# EAGLE design Multiplex Horizontal (EAGLE 7.5.0)
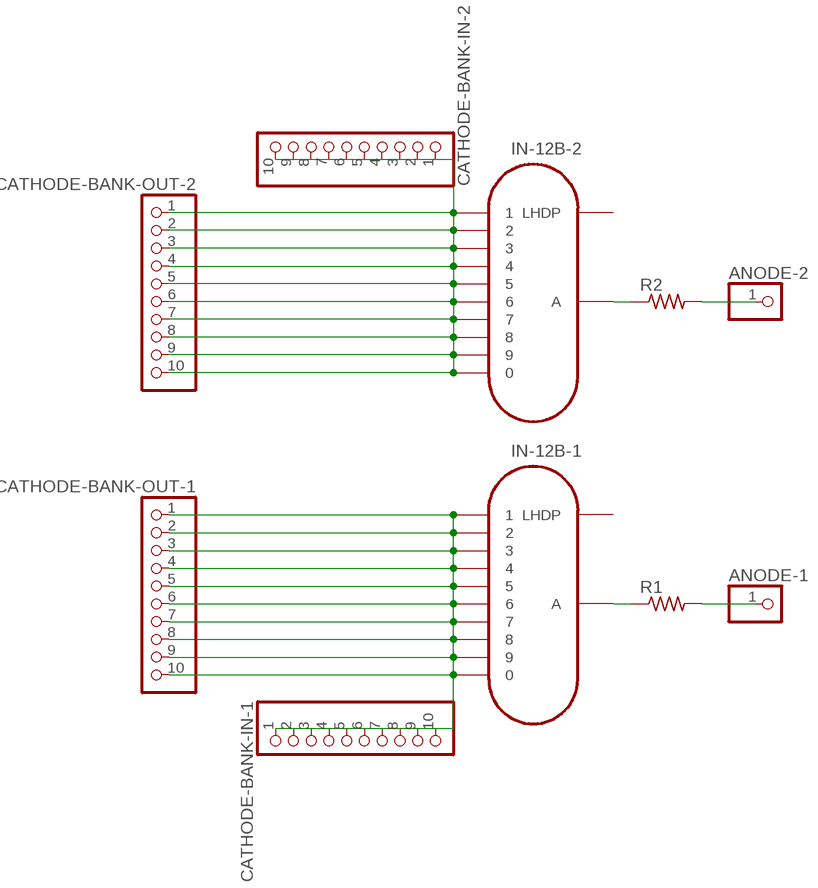
[diagram p0: schematic, sheet 1]

## Parts
ANODE-1  PINHD-1X1  [1X01]
ANODE-2  PINHD-1X1  [1X01]
CATHODE-BANK-IN-1  PINHD-1X10  [1X10]
CATHODE-BANK-IN-2  PINHD-1X10  [1X10]
CATHODE-BANK-OUT-1  PINHD-1X10  [1X10]
CATHODE-BANK-OUT-2  PINHD-1X10  [1X10]
IN-12B-1  IN-12B  [IN-12]
IN-12B-2  IN-12B  [IN-12]
R1  R-US_0207/7  [0207/7]
R2  R-US_0207/7  [0207/7]

## Nets
N$1: IN-12B-2.A R2.1
N$2: CATHODE-BANK-IN-2.1 CATHODE-BANK-OUT-2.1 IN-12B-2.1
N$3: CATHODE-BANK-IN-2.2 CATHODE-BANK-OUT-2.2 IN-12B-2.2
N$4: CATHODE-BANK-IN-2.3 CATHODE-BANK-OUT-2.3 IN-12B-2.3
N$5: IN-12B-1.A R1.1
N$6: CATHODE-BANK-IN-2.5 CATHODE-BANK-OUT-2.5 IN-12B-2.5
N$7: CATHODE-BANK-IN-2.6 CATHODE-BANK-OUT-2.6 IN-12B-2.6
N$8: CATHODE-BANK-IN-2.7 CATHODE-BANK-OUT-2.7 IN-12B-2.7
N$9: CATHODE-BANK-IN-2.8 CATHODE-BANK-OUT-2.8 IN-12B-2.8
N$10: ANODE-2.1 R2.2
N$11: CATHODE-BANK-IN-2.9 CATHODE-BANK-OUT-2.9 IN-12B-2.9
N$12: ANODE-1.1 R1.2
N$13: CATHODE-BANK-IN-1.1 CATHODE-BANK-OUT-1.1 IN-12B-1.1
N$14: CATHODE-BANK-IN-1.2 CATHODE-BANK-OUT-1.2 IN-12B-1.2
N$15: CATHODE-BANK-IN-1.3 CATHODE-BANK-OUT-1.3 IN-12B-1.3
N$16: CATHODE-BANK-IN-1.4 CATHODE-BANK-OUT-1.4 IN-12B-1.4
N$17: CATHODE-BANK-IN-1.5 CATHODE-BANK-OUT-1.5 IN-12B-1.5
N$18: CATHODE-BANK-IN-1.6 CATHODE-BANK-OUT-1.6 IN-12B-1.6
N$19: CATHODE-BANK-IN-1.7 CATHODE-BANK-OUT-1.7 IN-12B-1.7
N$20: CATHODE-BANK-IN-1.8 CATHODE-BANK-OUT-1.8 IN-12B-1.8
N$21: CATHODE-BANK-IN-1.9 CATHODE-BANK-OUT-1.9 IN-12B-1.9
N$22: CATHODE-BANK-IN-2.10 CATHODE-BANK-OUT-2.10 IN-12B-2.0
N$23: CATHODE-BANK-IN-1.10 CATHODE-BANK-OUT-1.10 IN-12B-1.0
N$24: CATHODE-BANK-IN-2.4 CATHODE-BANK-OUT-2.4 IN-12B-2.4
Unconnected: IN-12B-1.LHDP IN-12B-2.LHDP

## Library data of the parts
ANODE-1 ANODE-2 = pinhead:PINHD-1X1: PIN HEADER
CATHODE-BANK-IN-1 CATHODE-BANK-IN-2 CATHODE-BANK-OUT-1 CATHODE-BANK-OUT-2 = pinhead:PINHD-1X10: PIN HEADER
IN-12B-1 IN-12B-2 = russian-nixies:IN-12B: IN-12B: medium numeric topview nixie tube
R1 R2 = resistor:R-US_: RESISTOR, American symbol

## Board
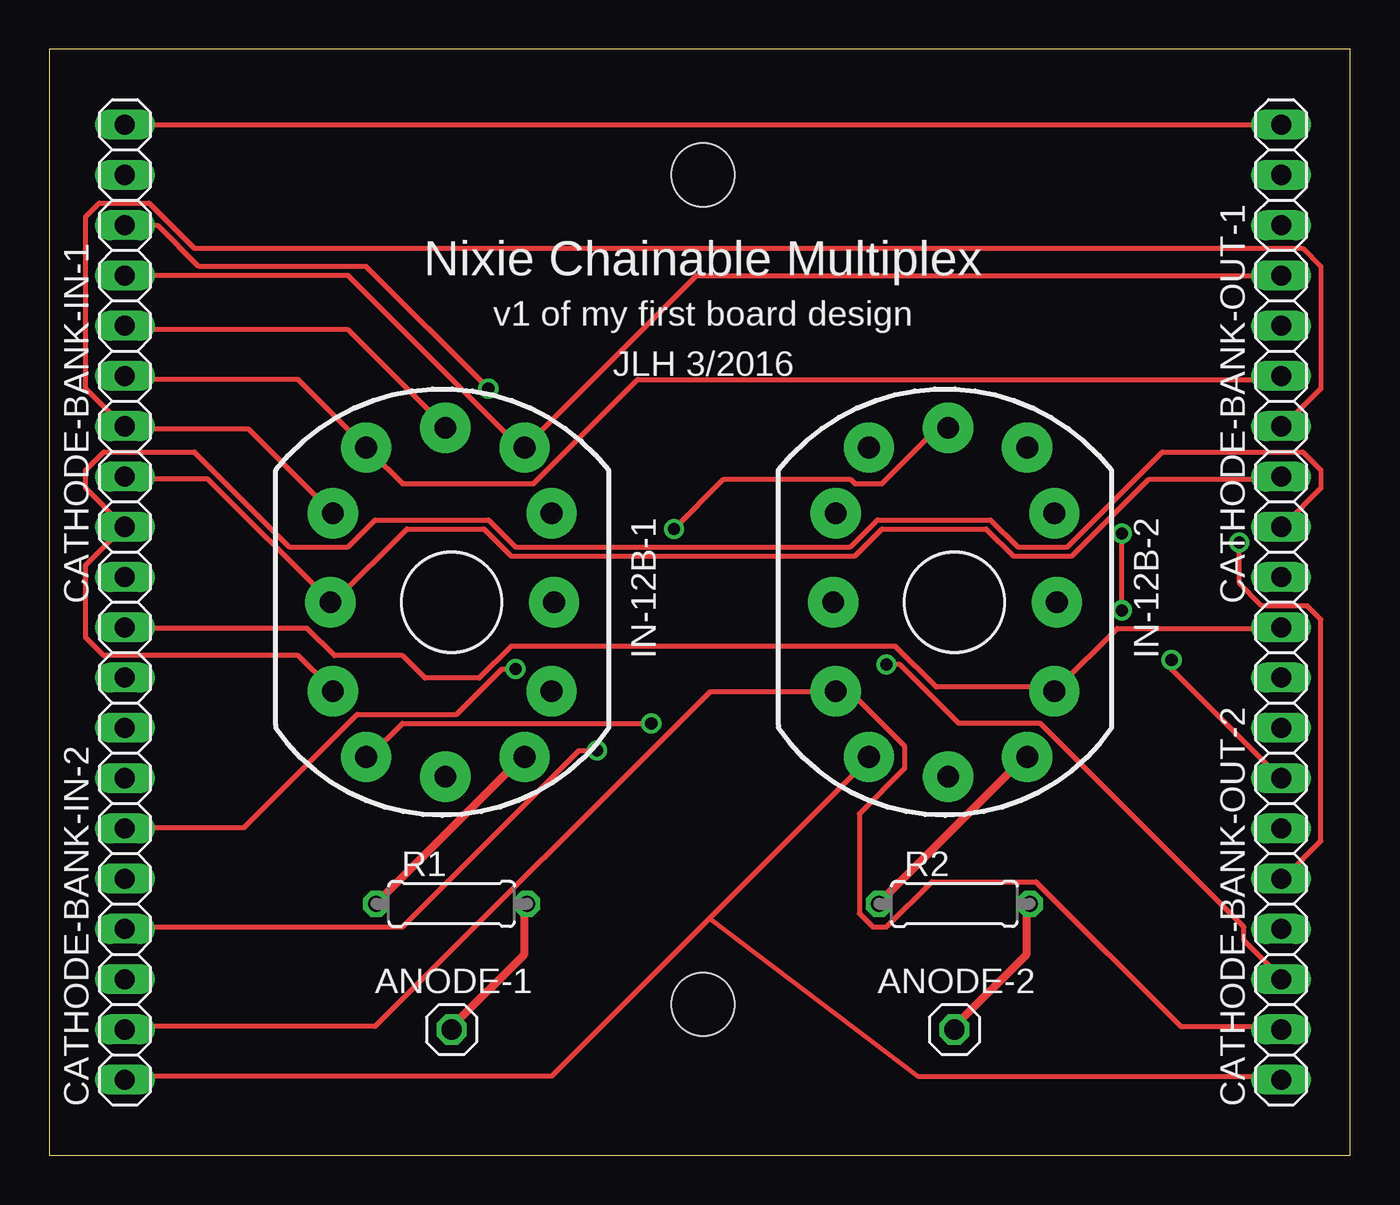
[diagram p1: board, top side]
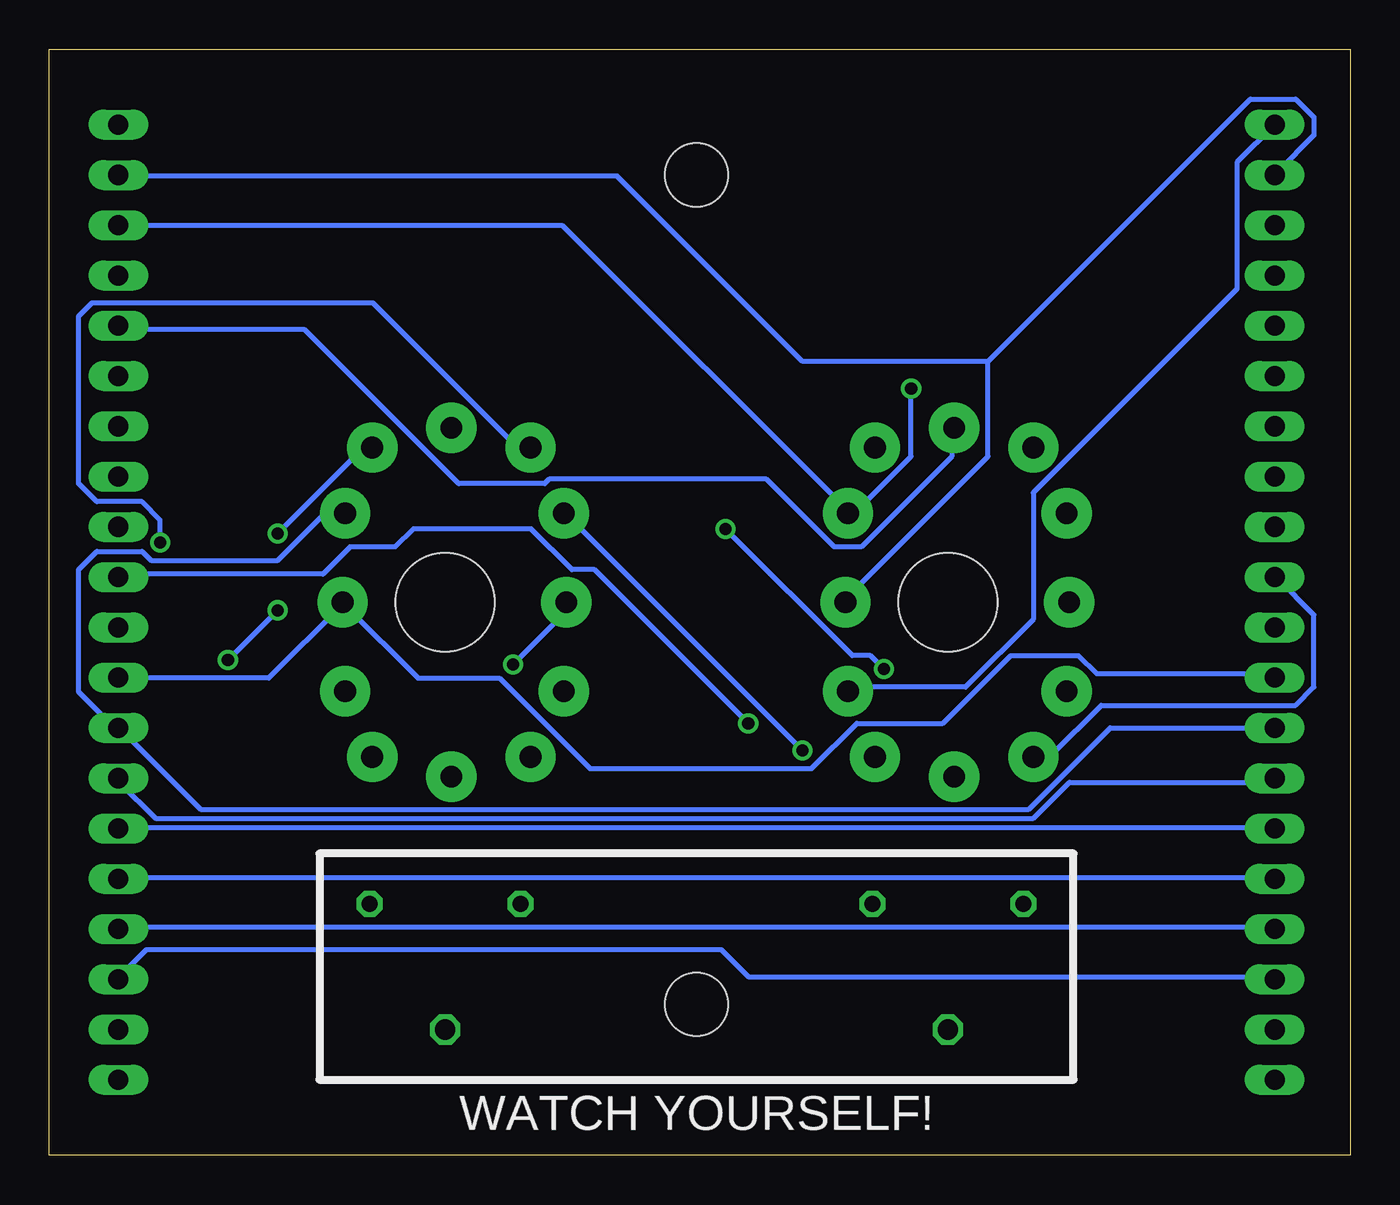
[diagram p2: board, bottom side, seen from below]

Size 65.71 x 55.87 mm. Coordinates in mm from the lower left corner, seen from the top.
Outline: 0,0 65.71,0 65.71,55.87 0,55.87 0,0
Copper layers (1*16): Top 0.035mm / dielectric 1.5mm / Bottom 0.035mm
Design rules "default": minimum track width 10mil, minimum drill 24mil, track to track 8mil, track to pad 8mil, pad to pad 8mil, via to via 8mil, smd to smd 8mil, copper to edge 40mil, drill to drill 8mil, minimum pad ring 10mil, minimum via ring 8mil, stop-mask expansion 4mil, vias tented up to drill 0mil, thermal gap 10mil
Holes 3.2 mm at 33.02,49.53 33.02,7.62

### Footprints (pad centres in the part's own frame; a part is rotated, then mirrored left to right if it is on the bottom)
1X01 = drill 1.016 octagon: 1 0,0
1X10 = drill 1.016 long: 1 -11.43,0; 2 -8.89,0; 3 -6.35,0; 4 -3.81,0; 5 -1.27,0; 6 1.27,0; 7 3.81,0; 8 6.35,0; 9 8.89,0; 10 11.43,0
IN-12 = drill 1.1 pad 2.54: 0 5.048,-4.5; 1 -4.317,-7.817; 2 -6,-4.5; 3 -6.127,0; 4 -6,4.5; 5 -4.317,7.817; 6 -0.318,8.818; 7 3.683,7.817; 8 5.048,4.5; 9 5.175,0; A 3.683,-7.817; LHDP -0.318,-8.818 | hole 5: 0,0
0207/7 = drill 0.813 octagon: 1 -3.81,0; 2 3.81,0

### Placement (x,y rotation side)
ANODE-1  20.32,6.35 0 top
ANODE-2  45.72,6.35 0 top
CATHODE-BANK-IN-1  3.81,40.64 90 top
CATHODE-BANK-IN-2  3.81,15.24 90 top
CATHODE-BANK-OUT-1  62.23,40.64 90 top
CATHODE-BANK-OUT-2  62.23,15.24 90 top
IN-12B-1  20.32,27.94 0 top
IN-12B-2  45.72,27.94 0 top
R1  20.32,12.7 0 top
R2  45.72,12.7 0 top

### Tracks (layer width: path | path; a pad name or v marks a point on that pad's centre or on a via)
N$1
  Top 0.254: 42.06,12.9 R2.1 | 49.38,20.22 IN-12B-2.A
  Top 0.406: 49.38,20.22 42.06,12.9
N$2
  Top 0.254: 33.35,11.96 41.38,19.99 IN-12B-2.1 | 33.35,11.96 25.38,3.99 3.89,3.99 CATHODE-BANK-IN-2.1 | 33.35,11.96 43.87,3.99 62.18,3.99 CATHODE-BANK-OUT-2.1
N$3
  Top 0.254: CATHODE-BANK-IN-2.2 3.89,6.5 16.46,6.5 33.38,23.42 39.55,23.42 IN-12B-2.2 39.78,23.42 40.46,23.42 43.2,20.68 43.2,19.53 40.92,17.25 40.92,12.22 41.6,11.53 42.29,11.53 44.58,13.82 49.84,13.82 57.15,6.5 62.18,6.5 CATHODE-BANK-OUT-2.2
N$4  (via drill 0.61)
  Top 0.254: v42.29,24.79 42.98,24.79 45.95,21.82 50.06,21.82 60.35,11.53 60.35,10.85 62.18,9.02 CATHODE-BANK-OUT-2.3
  Bottom 0.254: CATHODE-BANK-IN-2.3 3.89,9.02 30.4,9.02 31.77,10.39 60.81,10.39 62.18,9.02 CATHODE-BANK-OUT-2.3 | v42.29,24.79 39.78,27.31 39.78,27.76 IN-12B-2.3
N$5
  Top 0.254: 16.69,12.9 R1.1 | 23.77,19.99 IN-12B-1.A
  Top 0.406: 23.77,19.99 16.69,12.9
N$6  (via drill 0.61)
  Top 0.254: v60.12,30.96 60.12,28.9 61.27,27.76 63.55,27.76 64.24,27.08 64.24,15.88 62.41,14.05 CATHODE-BANK-OUT-2.5
  Bottom 0.254: CATHODE-BANK-IN-2.5 3.89,14.05 62.18,14.05 CATHODE-BANK-OUT-2.5 | v60.12,30.96 60.12,32.11 61.04,33.02 63.32,33.02 64.24,33.93 64.24,42.39 63.55,43.08 49.38,43.08 42.06,35.76 41.6,35.76 IN-12B-2.5
N$7  (via drill 0.61)
  Top 0.254: v31.55,31.65 34.06,34.16 40.46,34.16 40.69,33.93 42.06,33.93 44.81,36.68 45.26,36.68 IN-12B-2.6 | v23.55,24.56 22.86,24.56 20.57,22.28 15.54,22.28 9.83,16.56 3.89,16.56 CATHODE-BANK-IN-2.6
  Bottom 0.254: CATHODE-BANK-IN-2.6 3.89,16.56 62.18,16.56 CATHODE-BANK-OUT-2.6 | v31.55,31.65 25.15,25.25 24.23,25.25 v23.55,24.56
N$8  (via drill 0.61)
  Top 0.254: v54.18,27.53 v54.18,31.42 | v56.69,25.02 56.69,24.56 62.18,19.07 CATHODE-BANK-OUT-2.7
  Bottom 0.254: CATHODE-BANK-IN-2.7 3.89,18.85 14.17,18.85 16,17.02 60.35,17.02 62.18,18.85 CATHODE-BANK-OUT-2.7 | v54.18,31.42 50.06,35.53 49.61,35.53 IN-12B-2.7 | v56.69,25.02 v54.18,27.53
N$9
  Bottom 0.254: CATHODE-BANK-IN-2.8 12.12,21.59 16.23,17.47 58.06,17.47 62.18,21.59 CATHODE-BANK-OUT-2.8 62.41,21.59 64.24,23.42 64.24,29.59 63.32,30.5 61.04,30.5 60.58,30.05 54.18,30.05 51.89,32.33 50.98,32.33 IN-12B-2.8
N$10
  Top 0.254: 49.38,12.68 R2.2 | 45.72,6.5 ANODE-2.1
  Top 0.406: 49.38,12.68 49.38,10.16 45.72,6.5
N$11
  Bottom 0.254: CATHODE-BANK-IN-2.9 3.89,24.33 12.8,24.33 13.72,25.25 17.14,25.25 20.57,21.82 24.92,21.82 27.2,19.53 38.41,19.53 42.98,24.11 47.09,24.11 50.75,27.76 IN-12B-2.9 50.98,27.76 54.63,24.11 62.18,24.11 CATHODE-BANK-OUT-2.9
N$12
  Top 0.254: 24,12.68 R1.2 | 20.34,6.5 ANODE-1.1
  Top 0.406: 24,12.68 24,10.16 20.34,6.5
N$13  (via drill 0.61)
  Top 0.254: v30.4,21.82 17.83,21.82 16.23,20.22 IN-12B-1.1
  Bottom 0.254: CATHODE-BANK-IN-1.1 3.66,29.13 1.83,27.31 1.83,23.65 2.74,22.73 12.57,22.73 15.09,20.22 16,20.22 IN-12B-1.1 | v30.4,21.82 38.18,29.59 39.32,29.59 41.38,31.65 47.32,31.65 48.23,30.73 50.52,30.73 51.89,29.36 62.18,29.36 CATHODE-BANK-OUT-1.1
N$14
  Top 0.254: IN-12B-1.2 14.17,23.65 12.57,25.25 2.74,25.25 1.83,26.16 1.83,29.82 3.66,31.65 CATHODE-BANK-IN-1.2 3.66,31.88 1.83,33.71 1.83,34.62 2.74,35.53 7.32,35.53 12.12,30.73 15.09,30.73 16.46,32.11 22.17,32.11 23.55,30.73 40.46,30.73 41.83,32.11 47.55,32.11 48.92,30.73 51.44,30.73 56.24,35.53 63.32,35.53 64.24,34.62 64.24,33.71 62.41,31.88 CATHODE-BANK-OUT-1.2
N$15
  Top 0.254: CATHODE-BANK-IN-1.3 3.89,34.16 8,34.16 14.17,27.99 IN-12B-1.3 14.4,27.99 18.06,31.65 21.95,31.65 23.32,30.28 40.69,30.28 42.06,31.65 47.32,31.65 48.69,30.28 51.66,30.28 55.55,34.16 62.18,34.16 CATHODE-BANK-OUT-1.3
N$16
  Top 0.254: IN-12B-1.4 14.17,32.56 10.06,36.68 3.89,36.68 CATHODE-BANK-IN-1.4 3.66,36.91 1.83,38.73 1.83,47.42 2.52,48.11 5.03,48.11 7.32,45.82 63.32,45.82 64.24,44.91 64.24,38.73 62.41,36.91 CATHODE-BANK-OUT-1.4
N$17
  Top 0.254: CATHODE-BANK-IN-1.5 3.89,39.19 12.57,39.19 IN-12B-1.5 16.23,35.53 17.83,33.93 24.46,33.93 29.72,39.19 62.18,39.19 CATHODE-BANK-OUT-1.5
N$18
  Top 0.254: CATHODE-BANK-IN-1.6 3.89,41.71 15.09,41.71 19.89,36.91 IN-12B-1.6
  Bottom 0.254: CATHODE-BANK-OUT-1.6 62.18,41.71 52.81,41.71 45.03,33.93 40.69,33.93 40.46,34.16 29.49,34.16 26.06,30.73 24.69,30.73 20.12,35.31 20.12,36.68 IN-12B-1.6
N$19
  Top 0.254: CATHODE-BANK-IN-1.7 15.09,44.45 23.77,35.76 IN-12B-1.7 32.69,44.45 CATHODE-BANK-OUT-1.7
N$20  (via drill 0.61)
  Top 0.254: v22.17,38.73 16,44.91 7.54,44.91 5.49,46.97 3.89,46.97 CATHODE-BANK-IN-1.8
  Bottom 0.254: v22.17,38.73 22.17,35.31 25.15,32.33 IN-12B-1.8 25.38,32.56 39.78,46.97 62.18,46.97 CATHODE-BANK-OUT-1.8
N$21
  Bottom 0.254: 18.29,40.11 5.03,53.37 2.74,53.37 1.83,52.45 1.83,51.54 3.66,49.71 CATHODE-BANK-IN-1.9 | 18.29,40.11 18.29,35.31 25.6,27.99 IN-12B-1.9 | 18.29,40.11 27.66,40.11 37.03,49.48 62.18,49.48 CATHODE-BANK-OUT-1.9
N$22
  Top 0.254: CATHODE-BANK-IN-2.10 3.89,26.62 13.03,26.62 14.4,25.25 17.83,25.25 18.97,24.11 21.72,24.11 23.32,25.71 42.75,25.71 44.81,23.65 50.75,23.65 IN-12B-2.0 50.98,23.65 53.95,26.62 62.18,26.62 CATHODE-BANK-OUT-2.10
N$23
  Top 0.254: CATHODE-BANK-IN-1.10 CATHODE-BANK-OUT-1.10
  Bottom 0.254: CATHODE-BANK-IN-1.10 5.71,50.17 5.71,43.76 16,33.48 16,27.08 19.43,23.65 25.15,23.65 IN-12B-1.0
N$24  (via drill 0.61)
  Top 0.254: v27.66,20.45 26.75,20.45 17.83,11.53 3.89,11.53 CATHODE-BANK-IN-2.4
  Bottom 0.254: CATHODE-BANK-IN-2.4 3.89,11.53 62.18,11.53 CATHODE-BANK-OUT-2.4 | v27.66,20.45 39.55,32.33 IN-12B-2.4

### Text on the board
tPlace: Nixie Chainable Multiplex | v1 of my first board design | JLH 3/2016
bPlace: WATCH YOURSELF!